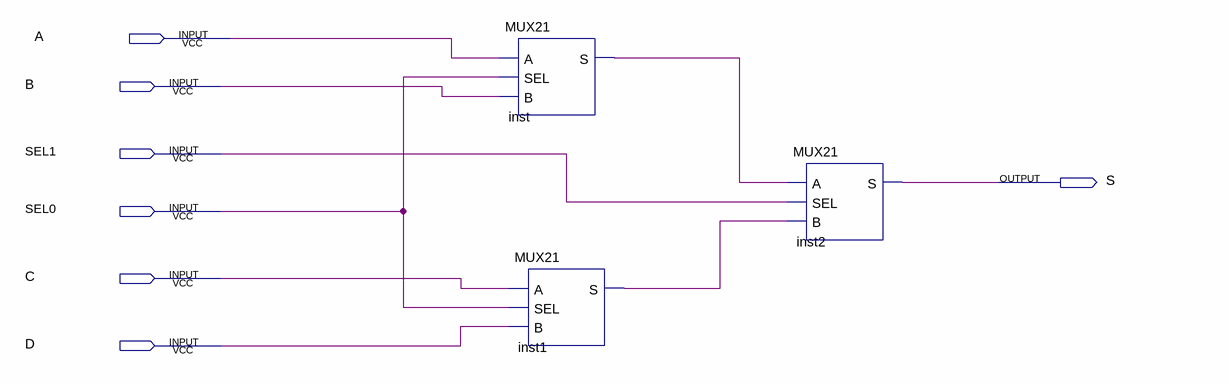
[diagram p0: schematic sheet]
// Quartus schematic MUX41.bdf as structural Verilog: 3 symbols, 7 pins
module MUX41 (
  input  A,
  input  B,
  input  SEL1,
  input  SEL0,
  input  C,
  input  D,
  output S
);

  wire inst1_s, inst_s;

  MUX21 inst (.A(A), .SEL(SEL0), .B(B), .S(inst_s));
  MUX21 inst1 (.A(C), .SEL(SEL0), .B(D), .S(inst1_s));
  MUX21 inst2 (.A(inst_s), .SEL(SEL1), .B(inst1_s), .S(S));
endmodule
